# EasyEDA schematic SCHEMATIC_RELAY_DIFFERENTIAL.json
TITLE: PROJECT SIMULASI RELAY DIFERENSIAL; REV: 1.0; Date: 2024-07-03; Sheet: 1/1; Drawn By: ANDRI; Company: PROJEKITA
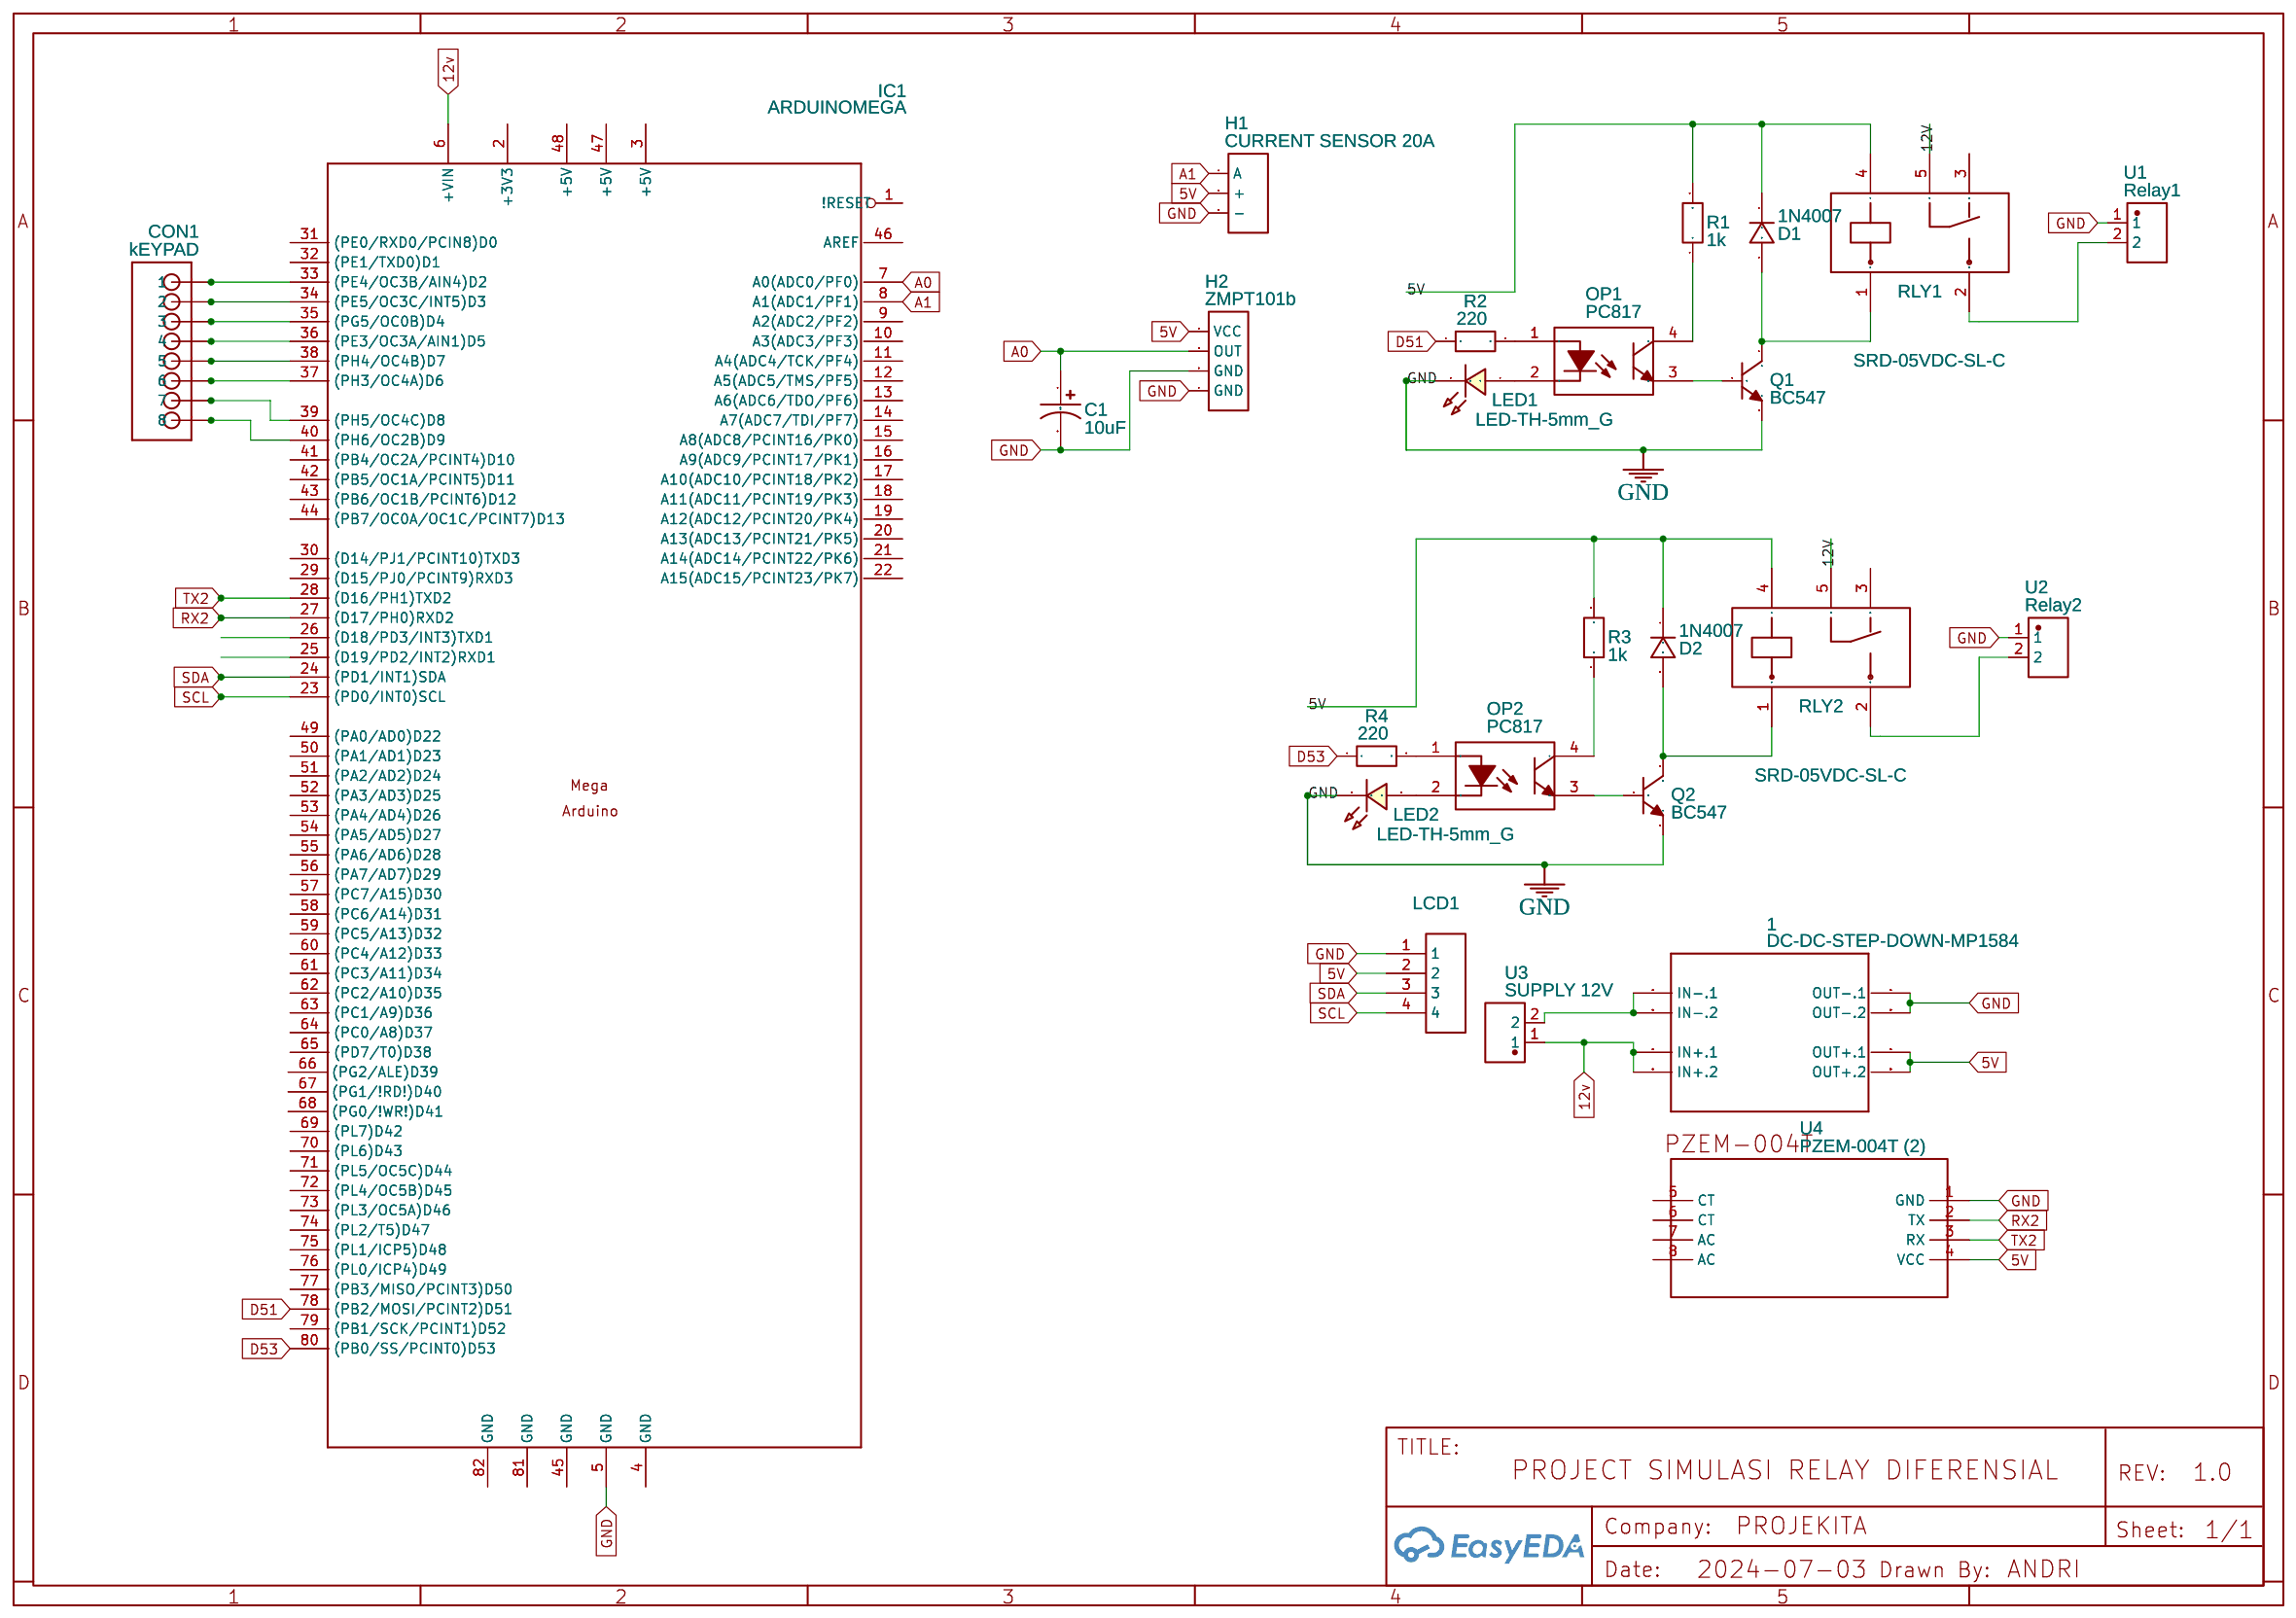
[diagram p0: schematic sheet]

## Parts
1  DC-DC-STEP-DOWN-MP1584  [DC-DC-STEP-DOWN-MP1584]
C1  10uF  [CAP-D4.0×F1.5]
CON1  kEYPAD  [JST XH2.54 8 PIN]
D1  1N4007  [DO-41_BD2.4-L4.7-P8.70-D0.9-RD]
D2  1N4007  [DO-41_BD2.4-L4.7-P8.70-D0.9-RD]
H1  CURRENT SENSOR 20A  [HDR-F-2.54_1X3]
H2  ZMPT101b  [HDR-F-2.54_1X4]
IC1  ARDUINOMEGA  [ARDUINOMEGA]
LCD1  NO  [JST XH2.54 4 PIN]
LED1  LED-TH-5mm_G  [LED-TH_BD5.0_GREEN]
LED2  LED-TH-5mm_G  [LED-TH_BD5.0_GREEN]
OP1  PC817  [PC817]
OP2  PC817  [PC817]
Q1  BC547  [TO-92-3_L4.5-W3.5-P1.27-L]
Q2  BC547  [TO-92-3_L4.5-W3.5-P1.27-L]
R1  1k  [R_AXIAL-0.4]
R2  220  [R_AXIAL-0.4]
R3  1k  [R_AXIAL-0.4]
R4  220  [R_AXIAL-0.4]
RLY1  SRD-05VDC-SL-C  [RELAY-TH_SRD-XXVDC-XL-C]
RLY2  SRD-05VDC-SL-C  [RELAY-TH_SRD-XXVDC-XL-C]
U1  Relay1  [CONN-TH_KF25H-7.62-2P]
U2  Relay2  [CONN-TH_KF25H-7.62-2P]
U3  SUPPLY 12V  [CONN-TH_KF25H-7.62-2P]
U4  PZEM-004T (2)  [PZEM-004T]

## Library data of the parts
1 = DC-DC-STEP-DOWN-MP1584: Contributor: MAYURESH INAMDAR
C1 = CE_TH_D4.0×F1.5_US: Contributor: LCEDA_Lib
CON1 = JST XH2.54 8P: Contributor: capsule5000
D1 D2 = 1N4007: Supplier: LCSC; Manufacturer: SEMTECH; Supplier Part: C106903; Contributor: LCEDA_Lib
H1 = HDR-F-2.54_1x3: Supplier Part: C146690; Supplier: LCSC; Contributor: LCEDA_Lib
H2 = HDR-F-2.54_1x4: Supplier Part: C225501; Supplier: LCSC; Contributor: LCEDA_Lib
IC1 = ARDUINOMEGA: Contributor: Martin Kristiansen
LCD1 = JST XH2.54 4 PIN: Contributor: aldino pramana
LED1 LED2 = LED-TH-5mm_G: Manufacturer: EVERLIGHT(台湾亿光); Manufacturer Part: 333-2SYGD/S530-E2; Supplier Part: C88163; Supplier: LCSC; Contributor: LCEDA_Lib
OP1 OP2 = PC817: image: //image.lceda.cn/szlcsc/C60965.jpg; Contributor: Yongbeom
Q1 Q2 = BC547: Contributor: LCSC; Supplier: LCSC; Supplier Part: C2910381; Manufacturer: CJ(江苏长电/长晶); JLCPCB Part Class: Extended Part
R1-R4 = R_AXIAL-0.4_EU: Contributor: LCEDA_Lib
RLY1 RLY2 = SRD-05VDC-SL-C: Supplier: LCSC; Manufacturer: 松乐; Supplier Part: C35449; JLCPCB Part Class: Extended Part
U1-U3 = KF25H-7.62-2P: Contributor: LCSC; Supplier: LCSC; Supplier Part: C707373; Manufacturer: KEFA(科发); JLCPCB Part Class: Extended Part; link: https://lcsc.com/eda_search?q=C707373&%26type=1&ref=editor
U4 = PZEM-004T: Contributor: fernandolopes38

## Nets
5V: 1.OUT+.1 1.OUT+.2 D1.1 D2.1 H1.2(+) H2.1(VCC) LCD1.2 R1.2 R3.2 RLY1.4 RLY2.4 U4.4(VCC)
12v: 1.IN+.1 1.IN+.2 IC1.6(+VIN) U3.1
12V: RLY1.5 RLY2.5
GND: 1.OUT-.1 1.OUT-.2 C1.2 H1.3(-) H2.3(GND) H2.4(GND) IC1.5(GND) LCD1.1 LED1.2 LED2.2 Q1.3(E) Q2.3(E) U1.1 U2.1 U4.1(GND)
A0: C1.1 H2.2(OUT) IC1.7(A0(ADC0/PF0))
A1: H1.1(A) IC1.8(A1(ADC1/PF1))
D51: IC1.78((PB2/MOSI/PCINT2)D51) R2.1
D53: IC1.80((PB0/SS/PCINT0)D53) R4.1
RX2: IC1.27((D17/PH0)RXD2) U4.2(TX)
SCL: IC1.23((PD0/INT0)SCL) LCD1.4
SDA: IC1.24((PD1/INT1)SDA) LCD1.3
TX2: IC1.28((D16/PH1)TXD2) U4.3(RX)
Net-(1-IN-.1): 1.IN-.1 1.IN-.2 U3.2
Net-(CON1-1): CON1.1 IC1.33((PE4/OC3B/AIN4)D2)
Net-(CON1-2): CON1.2 IC1.34((PE5/OC3C/INT5)D3)
Net-(CON1-3): CON1.3 IC1.35((PG5/OC0B)D4)
Net-(CON1-4): CON1.4 IC1.36((PE3/OC3A/AIN1)D5)
Net-(CON1-5): CON1.5 IC1.38((PH4/OC4B)D7)
Net-(CON1-6): CON1.6 IC1.37((PH3/OC4A)D6)
Net-(CON1-7): CON1.7 IC1.39((PH5/OC4C)D8)
Net-(CON1-8): CON1.8 IC1.40((PH6/OC2B)D9)
Net-(D1-2): D1.2 Q1.1(C) RLY1.1
Net-(D2-2): D2.2 Q2.1(C) RLY2.1
Net-(LED1-1): LED1.1 OP1.2
Net-(LED2-1): LED2.1 OP2.2
Net-(OP1-1): OP1.1 R2.2
Net-(OP1-3): OP1.3 Q1.2(B)
Net-(OP1-4): OP1.4 R1.1
Net-(OP2-1): OP2.1 R4.2
Net-(OP2-3): OP2.3 Q2.2(B)
Net-(OP2-4): OP2.4 R3.1
Net-(RLY1-2): RLY1.2 U1.2
Net-(RLY2-2): RLY2.2 U2.2

Not connected (* = marked no-connect by the designer): IC1 1(!RESET) 2(+3V3) 3(+5V) 4(GND) 9(A2(ADC2/PF2)) 10(A3(ADC3/PF3)) 11(A4(ADC4/TCK/PF4)) 12(A5(ADC5/TMS/PF5)) 13(A6(ADC6/TDO/PF6)) 14(A7(ADC7/TDI/PF7)) 15(A8(ADC8/PCINT16/PK0)) 16(A9(ADC9/PCINT17/PK1)) 17(A10(ADC10/PCINT18/PK2)) 18(A11(ADC11/PCINT19/PK3)) 19(A12(ADC12/PCINT20/PK4)) 20(A13(ADC13/PCINT21/PK5)) 21(A14(ADC14/PCINT22/PK6)) 22(A15(ADC15/PCINT23/PK7)) 25((D19/PD2/INT2)RXD1) 26((D18/PD3/INT3)TXD1) 29((D15/PJ0/PCINT9)RXD3) 30((D14/PJ1/PCINT10)TXD3) 31((PE0/RXD0/PCIN8)D0) 32((PE1/TXD0)D1) 41((PB4/OC2A/PCINT4)D10) 42((PB5/OC1A/PCINT5)D11) 43((PB6/OC1B/PCINT6)D12) 44((PB7/OC0A/OC1C/PCINT7)D13) 45(GND) 46(AREF) 47(+5V) 48(+5V) 49((PA0/AD0)D22) 50((PA1/AD1)D23) 51((PA2/AD2)D24) 52((PA3/AD3)D25) 53((PA4/AD4)D26) 54((PA5/AD5)D27) 55((PA6/AD6)D28) 56((PA7/AD7)D29) 57((PC7/A15)D30) 58((PC6/A14)D31) 59((PC5/A13)D32) 60((PC4/A12)D33) 61((PC3/A11)D34) 62((PC2/A10)D35) 63((PC1/A9)D36) 64((PC0/A8)D37) 65((PD7/T0)D38) 66((PG2/ALE)D39) 67((PG1/!RD!)D40) 68((PG0/!WR!)D41) 69((PL7)D42) 70((PL6)D43) 71((PL5/OC5C)D44) 72((PL4/OC5B)D45) 73((PL3/OC5A)D46) 74((PL2/T5)D47) 75((PL1/ICP5)D48) 76((PL0/ICP4)D49) 77((PB3/MISO/PCINT3)D50) 79((PB1/SCK/PCINT1)D52) 81(GND) 82(GND); RLY1 3; RLY2 3; U4 5(CT) 6(CT) 7(AC) 8(AC)
